# EAGLE design PPGv2 (EAGLE 6.5.0)
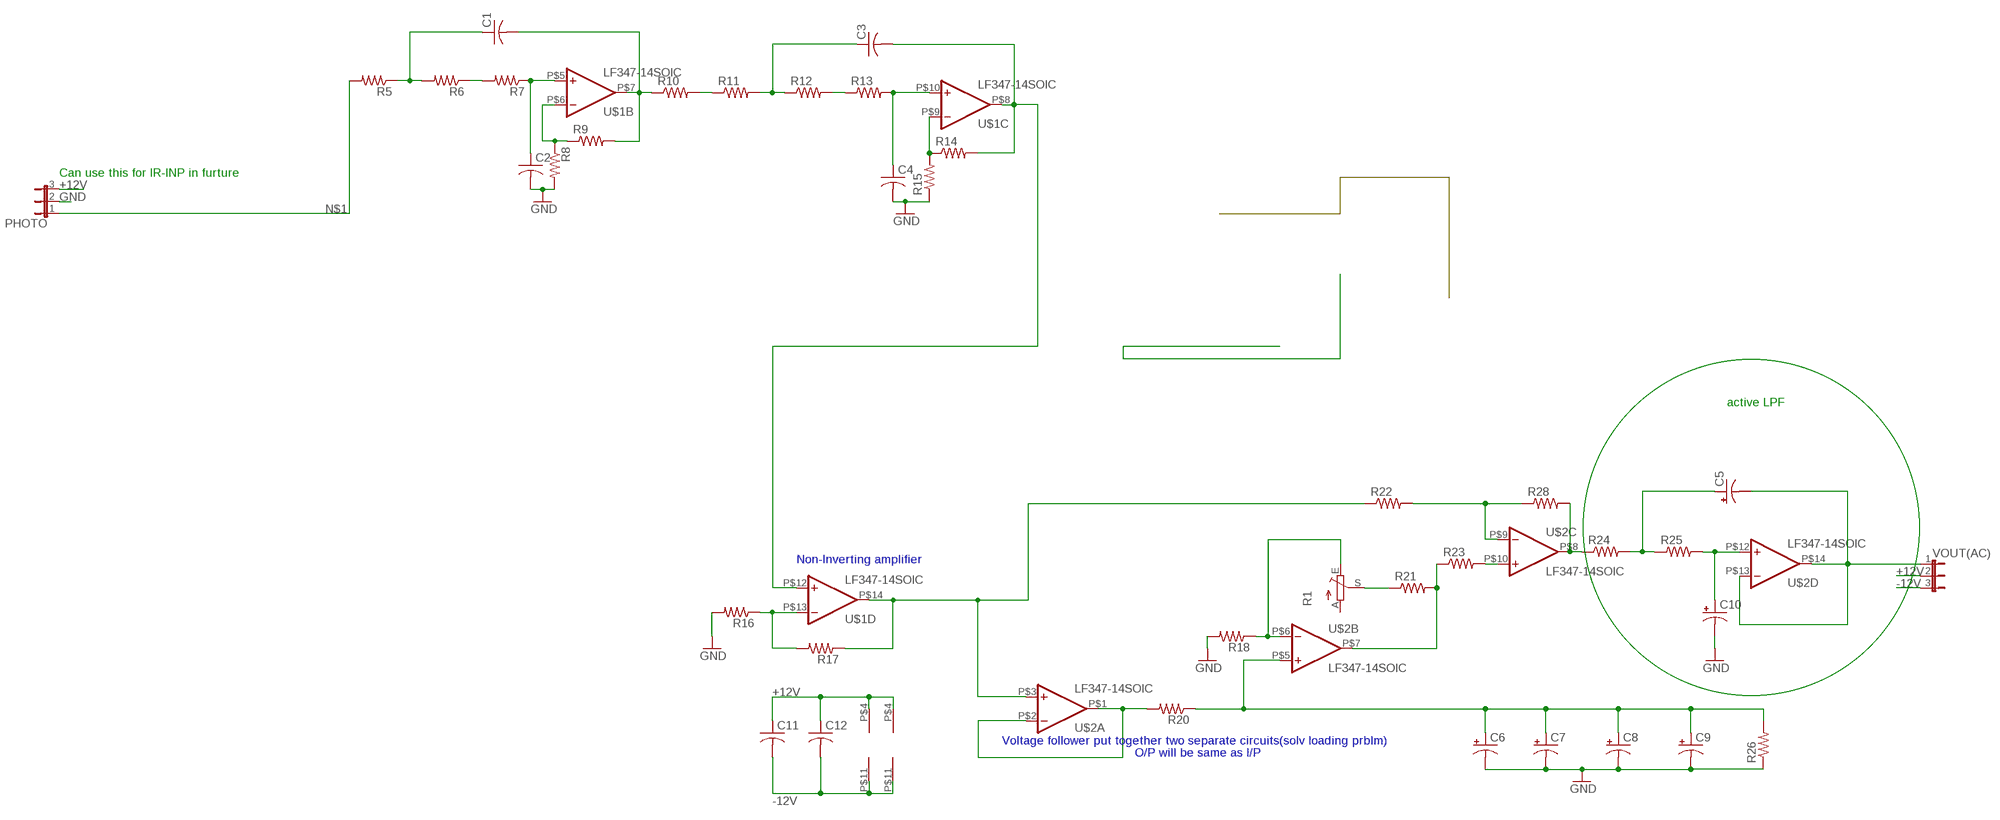
[diagram p0: schematic, sheet 1]

## Parts
C1  CAP0603  [C0603]
C2  CAP0603  [C0603]
C3  CAP0603  [C0603]
C4  CAP0603  [C0603]
C5  CAP_POL_10V  [C/6032-28R]
C6  CAP_POL_10V  [C/6032-28R]
C7  CAP_POL_10V  [C/6032-28R]
C8  CAP_POL_10V  [C/6032-28R]
C9  CAP_POL_10V  [C/6032-28R]
C10  CAP_POL_10V  [C/6032-28R]
C11  CAP0603  [C0603]
C12  CAP0603  [C0603]
PHOTO  JP2E  [JP2]
R1  TRIM_EU-RJ9W  [RJ9W]
R5  R-US_R0603  [R0603]
R6  R-US_R0603  [R0603]
R7  R-US_R0603  [R0603]
R8  R-US_R0603  [R0603]
R9  R-US_R0603  [R0603]
R10  R-US_R0603  [R0603]
R11  R-US_R0603  [R0603]
R12  R-US_R0603  [R0603]
R13  R-US_R0603  [R0603]
R14  R-US_R0603  [R0603]
R15  R-US_R0603  [R0603]
R16  R-US_R0603  [R0603]
R17  R-US_R0603  [R0603]
R18  R-US_R0603  [R0603]
R20  R-US_R0603  [R0603]
R21  R-US_R0603  [R0603]
R22  R-US_R0603  [R0603]
R23  R-US_R0603  [R0603]
R24  R-US_R0603  [R0603]
R25  R-US_R0603  [R0603]
R26  R-US_R0603  [R0603]
R28  R-US_R0603  [R0603]
U$1  LF347-14SOIC  [SOIC14]
U$2  LF347-14SOIC  [SOIC14]
VOUT(AC)  JP2E  [JP2]

## Nets
+12V: C11.1 C12.1 PHOTO.3 U$1.P$4(VCC) U$2.P$4(VCC) VOUT(AC).2
-12V: C11.2 C12.2 U$1.P$11(VEE) U$2.P$11(VEE) VOUT(AC).3
GND: C2.2 C4.2 C6.- C7.- C8.- C9.- C10.- PHOTO.2 R8.2 R15.1 R16.2 R18.2 R26.1
N$1: PHOTO.1 R5.2
N$2: R8.1 R9.1 U$1.P$6(B:IN-)
N$6: C1.1 R5.1 R6.2
N$7: R6.1 R7.2
N$8: C2.1 R7.1 U$1.P$5(B:IN+)
N$11: C4.1 R13.2 U$1.P$10(C:IN+)
N$12: C1.2 R9.2 R10.1 U$1.P$7(B:OUT)
N$13: R10.2 R11.1
N$14: C3.1 R11.2 R12.1
N$15: R12.2 R13.1
N$16: R14.1 R15.2 U$1.P$9(C:IN-)
N$17: R22.2 R28.1 U$2.P$9(C:IN-)
N$18: C3.2 R14.2 U$1.P$8(C:OUT) U$1.P$12(D:IN+)
N$19: R16.1 R17.2 U$1.P$13(D:IN-)
N$20: C5.- U$2.P$13(D:IN-) U$2.P$14(D:OUT) VOUT(AC).1
N$21: R24.1 R28.2 U$2.P$8(C:OUT)
N$22: R17.1 R22.1 U$1.P$14(D:OUT) U$2.P$3(A:IN+)
N$23: R23.2 U$2.P$10(C:IN+)
N$24: R21.2 R23.1 U$2.P$7(B:OUT)
N$25: R1.S R21.1
N$26: R1.E R18.1 U$2.P$6(B:IN-)
N$27: R20.2 U$2.P$1(A:OUT) U$2.P$2(A:IN-)
N$29: C6.+ C7.+ C8.+ C9.+ R20.1 R26.2 U$2.P$5(B:IN+)
N$31: C5.+ R24.2 R25.1
N$32: C10.+ R25.2 U$2.P$12(D:IN+)
Unconnected: R1.A U$1.P$1(A:OUT) U$1.P$2(A:IN-) U$1.P$3(A:IN+)

## Notes on the sheet
- Can use this for IR-INP in furture
- active LPF
- Non-Inverting amplifier
- Voltage follower put together two separate circuits(solv loading prblm)
- O/P will be same as I/P

## Library data of the parts
C1-C4 C11 C12 = CEDTv69:CAP
C5-C10 = CEDTv69:CAP_POL
PHOTO VOUT(AC) = jumper:JP2E: JUMPER
R1 = pot:TRIM_EU-: POTENTIOMETER
R5-R18 R20-R26 R28 = resistor:R-US_: RESISTOR, American symbol
U$1 U$2 = Op+Amps:LF347-14SOIC

## Board
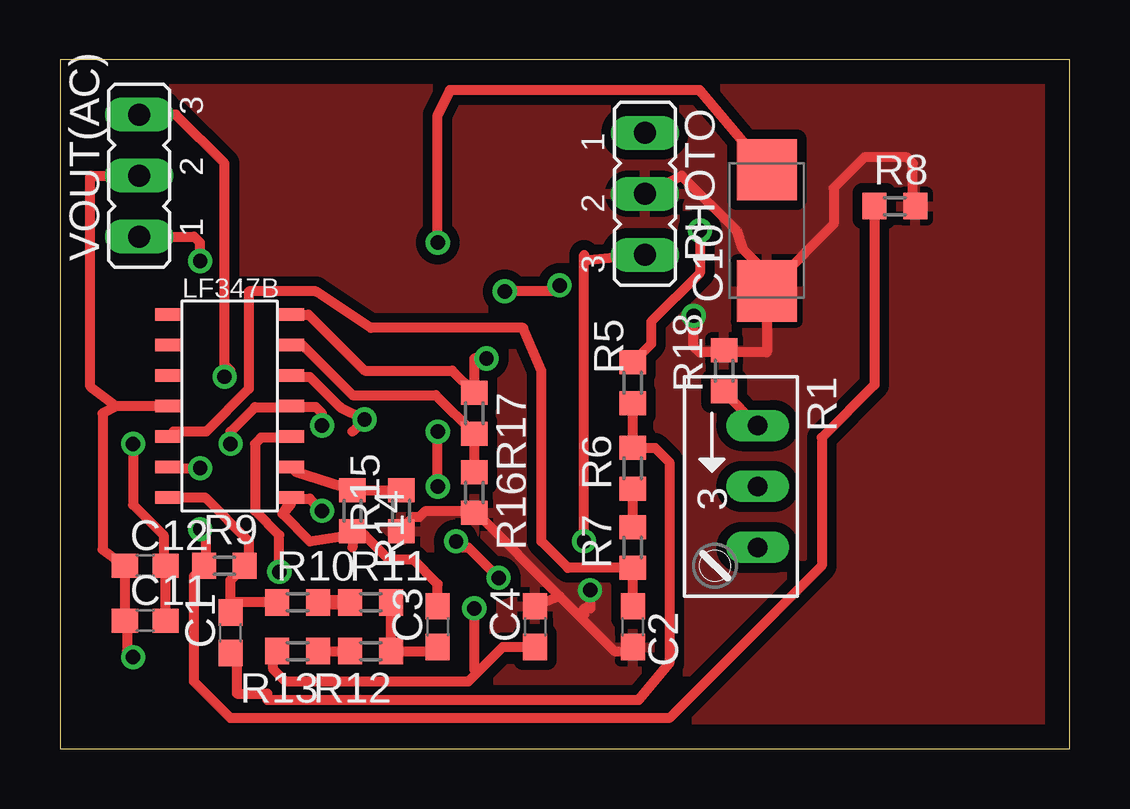
[diagram p1: board, top side]
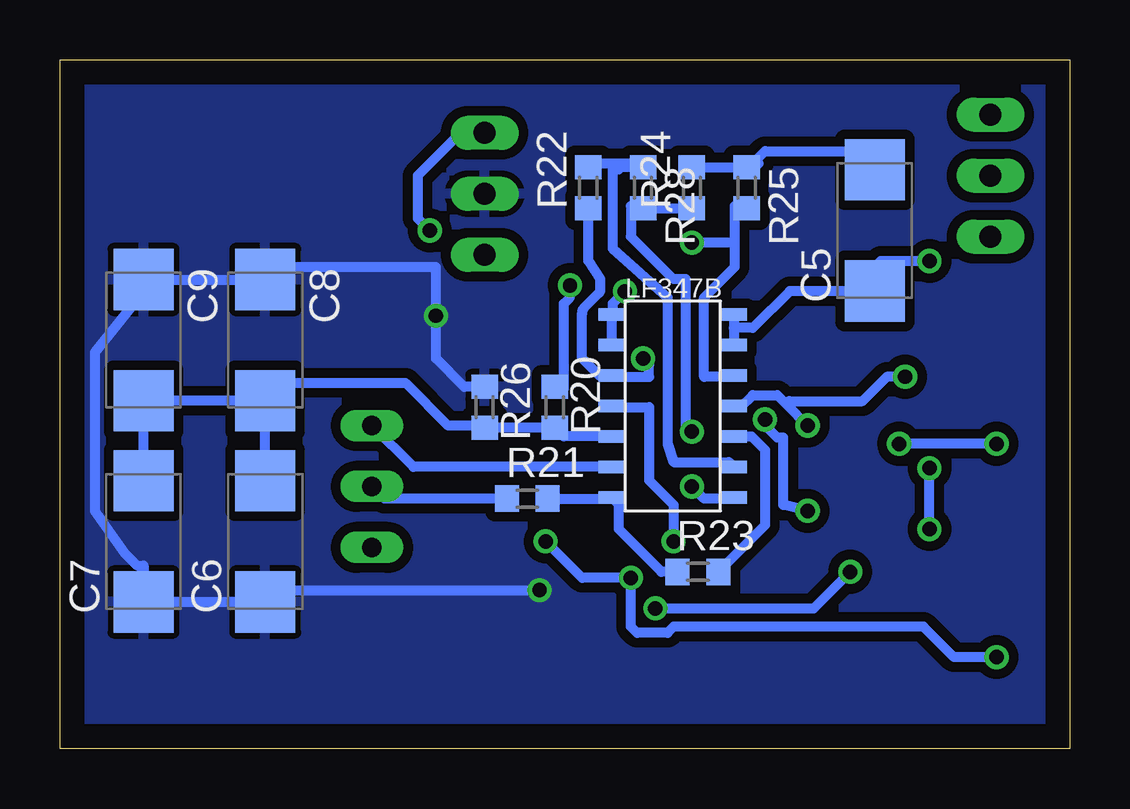
[diagram p2: board, bottom side, seen from below]

Size 42.09 x 28.69 mm. Coordinates in mm from the lower left corner, seen from the top.
Outline: 0,0 42.09,0 42.09,28.69 0,28.69 0,0
Copper layers (1*16): Top 0.035mm / dielectric 1.5mm / Bottom 0.035mm
Design rules "default *": minimum track width 10mil, minimum drill 13mil, track to track 8mil, track to pad 8mil, pad to pad 8mil, via to via 8mil, smd to smd 8mil, copper to edge 40mil, drill to drill 8mil, minimum pad ring 10mil, minimum via ring 8mil, stop-mask expansion 4mil, vias tented up to drill 0mil, thermal gap 10mil

### Footprints (pad centres in the part's own frame; a part is rotated, then mirrored left to right if it is on the bottom)
C0603 = smd 1.1 x 1: 1 -0.85,0; 2 0.85,0
C/6032-28R = smd 2.55 x 2.5: + 2.525,0; - -2.525,0
JP2 = drill 0.914 long: 1 -2.54,0; 2 0,0; 3 2.54,0
RJ9W = drill 0.813 long: A 2.54,0.635; E -2.54,0.635; S 0,0.635
R0603 = smd 1 x 1.1: 1 -0.85,0; 2 0.85,0
SOIC14 = smd 1.105 x 0.508: P$1 -0.551,8.179; P$2 -0.551,6.909; P$3 -0.551,5.639; P$4 -0.551,4.369; P$5 -0.551,3.099; P$6 -0.551,1.829; P$7 -0.551,0.559; P$8 4.54,0.559; P$9 4.54,1.829; P$10 4.54,3.099; P$11 4.54,4.369; P$12 4.54,5.639; P$13 4.54,6.909; P$14 4.54,8.179

### Placement (x,y rotation side)
C1  7.11,4.83 90 top
C2  23.88,5.08 270 top
C3  15.75,5.08 90 top
C4  19.81,5.08 90 top
C5  8.13,21.59 90 bottom
C6  33.53,8.64 90 bottom
C7  38.61,8.64 90 bottom
C8  33.53,17.02 270 bottom
C9  38.61,17.02 270 bottom
C10  29.46,21.59 90 top
C11  3.56,5.33 0 top
C12  3.56,7.62 0 top
PHOTO  24.38,23.11 270 top
R1  28.45,10.92 270 top
R5  23.88,15.24 90 top
R6  23.88,11.68 90 top
R7  23.88,8.38 90 top
R8  34.8,22.61 0 top
R9  6.86,7.62 0 top
R10  9.91,6.1 0 top
R11  12.95,6.1 0 top
R12  12.95,4.06 180 top
R13  9.91,4.06 180 top
R14  12.19,9.91 270 top
R15  14.22,9.91 90 top
R16  17.27,10.67 270 top
R17  17.27,13.97 270 top
R18  27.69,15.75 90 top
R20  21.46,14.22 90 bottom
R21  22.61,10.41 0 bottom
R22  20.07,23.37 90 bottom
R23  15.49,7.37 0 bottom
R24  15.75,23.37 90 bottom
R25  13.46,23.37 270 bottom
R26  24.38,14.22 270 bottom
R28  17.78,23.37 270 bottom
U$1  5.08,9.91 0 top
U$2  18.54,9.91 0 bottom
VOUT(AC)  3.3,23.88 90 top

### Tracks (layer width: path | path; a pad name or v marks a point on that pad's centre or on a via)
+12V  (via drill 0.6)
  Top 0.406: U$1.P$4 2.34,14.28 | 2.34,14.28 1.78,13.97 1.78,8.29 C12.1 C11.1 2.79,5.33 2.79,4.06 v3.05,3.81 | v21.84,8.64 21.84,20.32 | 21.84,20.32 21.84,20.57 | v18.29,7.11 17.02,8.38 16.51,8.38 v16.51,8.64 | 2.34,14.28 1.27,15.09 1.27,23.88 VOUT(AC).2 | PHOTO.3 21.84,20.32
  Bottom 0.406: v21.84,8.64 20.32,7.11 v18.29,7.11 18.29,5.08 18.03,4.83 16.76,4.83 16.51,5.08 6.1,5.08 4.83,3.81 v3.05,3.81 | v16.51,8.64 16.51,10.16 17.53,11.18 17.53,14.22 19.05,14.22 U$2.P$4
-12V  (via drill 0.6)
  Top 0.406: C11.2 C12.2 4.32,7.62 4.32,8.89 3.05,10.16 v3.05,12.7 | v10.92,13.46 10.92,13.97 10.67,14.22 9.65,14.22 U$1.P$11 9.4,14.22 8.13,14.22 7.11,13.21 v7.11,12.7 | v6.86,15.49 7.11,15.75 6.86,16 6.86,24.38 4.83,26.42 VOUT(AC).3
  Bottom 0.406: 11.81,14.35 12.19,14.73 13.21,14.73 13.72,14.22 13.97,14.22 U$2.P$11 | 11.81,14.35 v10.92,13.46 | v3.05,12.7 v7.11,12.7 | 11.81,14.35 11.68,14.48 8.64,14.48 7.62,15.49 v6.86,15.49
GND  (via drill 0.6)
  Top 0.406: R18.2 27.6,16.6 | R15.1 14.22,9.14 14.73,9.65 14.99,9.65 15.24,9.91 17.18,9.91 R16.2 17.36,9.82 20.83,6.35 | R8.2 35.56,22.61 35.56,24.38 35.31,24.64 33.53,24.64 32.26,23.37 32.26,21.86 29.84,19.44 | R18.2 27.69,16.51 29.46,16.51 C10.- 29.84,19.44 | 20.83,6.35 C4.2 | PHOTO.2 25.91,23.88 28.19,21.59 28.45,20.83 29.84,19.44 | v26.42,18.03 26.42,16.76 26.67,16.51 27.43,16.51 R18.2 | 20.83,6.35 21.72,5.46 | 21.72,5.46 23.11,4.06 23.71,4.06 C2.2 | 21.72,5.46 21.84,5.59 21.84,5.84 22.1,5.84 v22.1,6.6
  Bottom 0.406: R26.1 25.23,15.07 26.42,16.26 v26.42,18.03 26.42,20.07 33.02,20.07 33.02,20.05 C8.- C9.- 38.61,19.05 40.64,16.51 40.64,9.91 39.37,8.13 38.86,7.62 38.61,7.62 C7.- C6.- 33.53,6.6 v22.1,6.6
  pour Bottom (isolate 0.406): 0,28.7 42.16,28.7 42.16,0 0,0
  pour Top (isolate 0.406): 0,28.7 42.16,28.7 42.16,0 0,0
N$1  (via drill 0.6)
  Top 0.406: v26.67,21.59 26.67,19.81 24.64,17.78 24.64,16.85 R5.2
  Bottom 0.406: PHOTO.1 25.15,25.91 27.18,23.88 27.18,22.1 v26.67,21.59
N$2  (via drill 0.6)
  Top 0.406: U$1.P$6 4.57,11.68 5.59,11.68 5.84,11.43 v5.84,11.68 | v5.84,9.14 6.1,9.14 6.1,7.62 R9.1 5.59,7.2 5.59,2.79 7.11,1.27 25.4,1.27 31.75,7.62 31.75,12.95 33.95,15.15 R8.1
  Bottom 0.406: v5.84,9.14 v5.84,11.68
N$6
  Top 0.406: R5.1 R6.2 24.8,12.53 25.4,11.94 25.4,3.56 24.13,2.03 8.64,2.03 8.64,2.29 7.37,2.29 7.37,3.98 C1.1
N$7
  Top 0.406: R7.2 R6.1
N$8
  Top 0.406: C2.1 R7.1 21.17,7.53 20.07,8.64 20.07,15.75 19.3,17.53 12.95,17.53 10.67,19.05 7.87,19.05 7.87,14.99 6.1,13.21 4.73,13.21 U$1.P$5
N$11  (via drill 0.6)
  Top 0.406: C4.1 18.45,4.23 17.4,3.18 | 17.4,3.18 17.02,2.79 9.4,2.79 8.89,3.3 8.89,3.9 R13.2 | U$1.P$10 9.4,12.95 8.38,12.95 8.13,12.7 8.13,9.91 9.14,8.89 v9.14,7.37 | v17.27,5.84 17.27,3.3 17.4,3.18
  Bottom 0.406: v9.14,7.37 10.67,5.84 v17.27,5.84
N$12
  Top 0.406: R10.1 7.02,6.1 C1.2 7.11,7.02 R9.2 7.87,7.79 7.87,8.64 6.04,10.47 U$1.P$7
N$13
  Top 0.61: R10.2 R11.1
N$14
  Top 0.406: R11.2 R12.1 15.58,4.06 C3.1
N$15
  Top 0.406: R13.1 R12.2
N$16
  Top 0.406: R15.2 R14.1 9.84,11.52 U$1.P$9
N$17
  Bottom 0.406: R22.2 19.98,24.22 19.81,24.38 19.05,24.38 | 19.05,24.38 17.95,24.38 R28.1 18.71,24.22 18.8,24.13 19.05,24.38 | 19.05,24.38 19.05,20.83 16.76,18.8 16.76,12.7 16.51,11.94 14.2,11.94 U$2.P$9
N$18  (via drill 0.6)
  Top 0.406: R14.2 12.7,8.89 13.72,7.87 14.73,7.87 15.75,6.86 C3.2 | R14.2 12.19,8.38 | U$1.P$12 9.65,15.49 10.41,15.49 11.68,14.22 v12.7,13.72 12.19,13.21 | U$1.P$8 9.62,10.19 9.27,9.78 | 9.27,9.78 10.41,8.64 12.03,8.89 R14.2 | v10.92,9.91 10.41,10.41 9.65,10.41 9.27,9.78
  Bottom 0.406: v12.7,13.72 12.95,13.72 12.19,12.95 11.94,12.95 11.94,10.16 v10.92,9.91
N$19
  Top 0.406: R16.1 R17.2 15.66,14.73 12.19,14.73 10.11,16.82 U$1.P$13
N$20  (via drill 0.6)
  Top 0.406: v5.84,20.32 5.84,21.08 5.59,21.34 VOUT(AC).1
  Bottom 0.406: U$2.P$14 14,17.53 | 14,17.53 U$2.P$13 | 14,17.53 13.21,17.53 11.67,19.07 C5.- 8.13,20.07 7.87,20.32 v5.84,20.32
N$21  (via drill 0.6)
  Top 0.406: v15.75,10.92 v15.75,13.21
  Bottom 0.406: R24.1 R28.2 17.78,22.61 18.29,22.61 18.29,21.34 16.51,19.56 16,19.56 16,13.46 15.75,13.46 v15.75,13.21 | v15.75,10.92 15.24,10.41 14.22,10.41 U$2.P$8
N$22  (via drill 0.6)
  Top 0.406: 17.27,14.99 17.39,14.99 | U$1.P$14 10.36,18.09 12.7,15.75 16.34,15.75 R17.1 17.27,14.99 | 17.27,14.99 17.27,16.26 v17.78,16.26
  Bottom 0.406: v17.78,16.26 17.53,16 17.53,15.49 19.05,15.49 U$2.P$3 19.61,15.54 20.32,16.26 20.32,18.14 arc45 20.21,18.39 19.63,18.98 arc-45 19.56,19.16 19.56,19.56 20.07,20.32 R22.1
N$23
  Bottom 0.406: U$2.P$10 13.26,13.01 12.7,12.45 12.7,9.31 R23.2
N$24
  Bottom 0.406: R21.2 19.14,10.41 U$2.P$7 18.8,10.17 18.8,9.14 17.02,7.37 R23.1
N$25
  Bottom 0.406: R21.1 28.57,10.41 R1.S
N$26
  Top 0.406: R18.1 27.69,14.86 R1.E
  Bottom 0.406: U$2.P$6 27.36,11.74 R1.E
N$27  (via drill 0.6)
  Top 0.406: v18.54,19.05 20.83,19.05 v20.83,19.3
  Bottom 0.406: U$2.P$2 U$2.P$1 19.05,18.29 19.05,18.54 v18.54,19.05 | v20.83,19.3 20.83,18.8 21.08,18.54 21.08,14.99 21.34,14.99 R20.2
N$29
  Bottom 0.406: U$2.P$5 21.09,13.01 R20.1 R26.2 24.38,13.46 25.91,13.46 27.69,15.24 33.53,15.24 C8.+ 34.29,14.49 | 34.29,14.49 C9.+ C7.+ | 34.29,14.49 33.53,13.73 C6.+
N$31
  Bottom 0.406: R24.2 R25.1 | R25.1 13.12,24.22 12.95,24.38 13.21,24.38 | 13.21,24.38 13.3,24.38 R25.1 | 8.23,24.22 C5.+ 8.13,24.89 12.7,24.89 13.21,24.38 | 13.21,24.38 R25.1
N$32  (via drill 0.6)
  Top 0.406: C10.+ 29.48,24.12 26.67,27.43 16.26,27.43 15.75,26.42 v15.75,21.08
  Bottom 0.406: 13.97,21.08 13.97,22.61 13.46,22.61 R25.2 | 13.97,21.08 13.97,20.07 15.24,18.8 15.24,15.49 14.22,15.49 U$2.P$12 | 13.97,21.08 v15.75,21.08